# EAGLE design working (EAGLE 5.11)
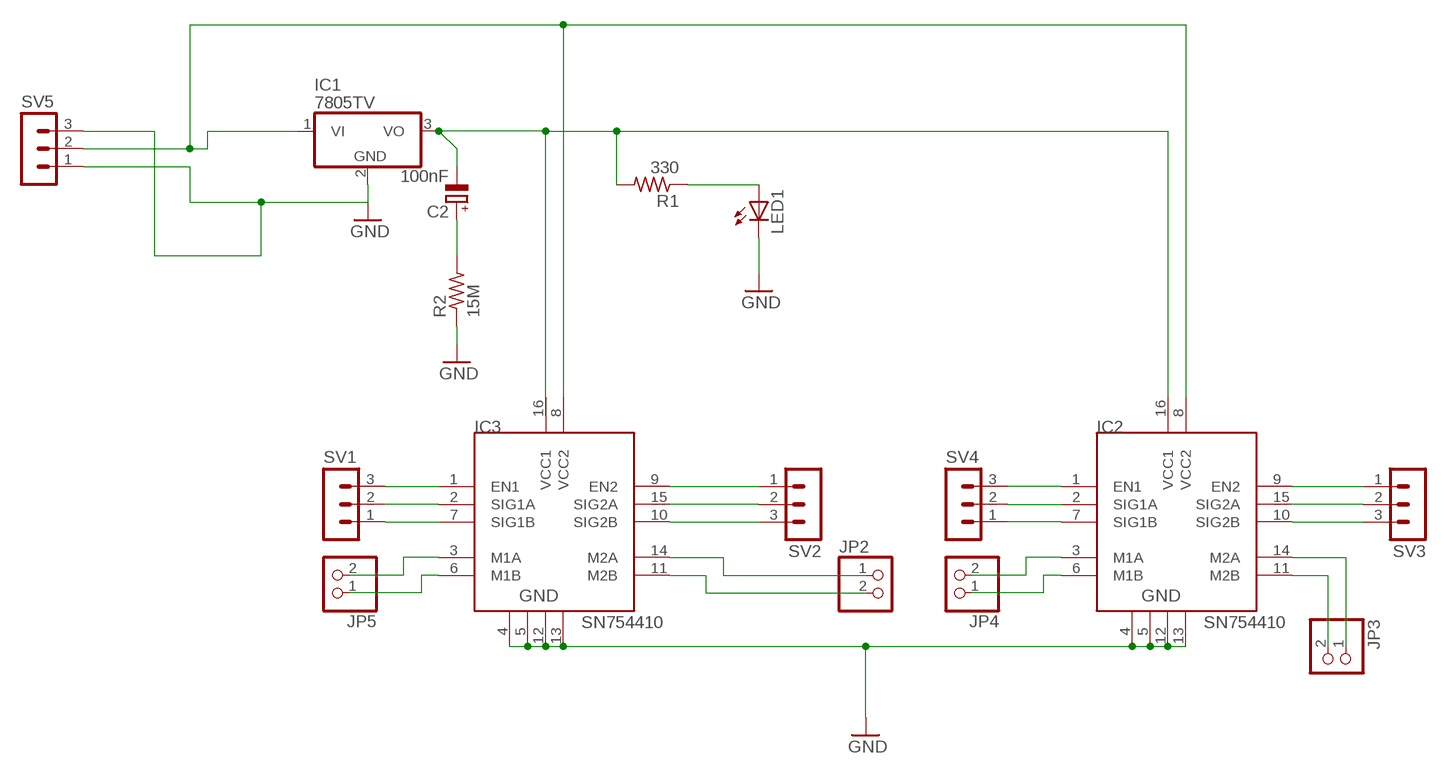
[diagram p0: schematic, sheet 1]

## Parts
C2  100nF  CPOL-EUE1.8-4  [E1,8-4]
IC1  7805TV  [TO220V]
IC2  SN754410  [DIP16]
IC3  SN754410  [DIP16]
JP2  PINHD-1X2  [1X02]
JP3  PINHD-1X2  [1X02]
JP4  PINHD-1X2  [1X02]
JP5  PINHD-1X2  [1X02]
LED1  LED5MM  [LED5MM]
R1  330  R-US_0204/5  [0204/5]
R2  15M  R-US_0204/5  [0204/5]
SV1  MA03-1  [MA03-1]
SV2  MA03-1  [MA03-1]
SV3  MA03-1  [MA03-1]
SV4  MA03-1  [MA03-1]
SV5  MA03-1  [MA03-1]

## Nets
GND: IC1.2(GND) IC2.4 IC2.5 IC2.12 IC2.13 IC3.4 IC3.5 IC3.12 IC3.13 LED1.K(C) R2.1 SV5.1 SV5.3
N$1: C2.- IC1.3(VO) IC2.16(VCC1) IC3.16(VCC1) R1.2
N$2: IC1.1(VI) IC2.8(VCC2) IC3.8(VCC2) SV5.2
N$3: IC3.1(EN1) SV1.3
N$4: IC3.2(SIG1A) SV1.2
N$5: IC3.7(SIG1B) SV1.1
N$6: IC3.3(M1A) JP5.2
N$7: IC3.6(M1B) JP5.1
N$8: IC3.11(M2B) JP2.2
N$9: IC3.14(M2A) JP2.1
N$10: IC3.9(EN2) SV2.1
N$11: IC3.15(SIG2A) SV2.2
N$12: IC3.10(SIG2B) SV2.3
N$13: IC2.1(EN1) SV4.3
N$14: IC2.2(SIG1A) SV4.2
N$15: IC2.7(SIG1B) SV4.1
N$16: IC2.3(M1A) JP4.2
N$17: IC2.6(M1B) JP4.1
N$18: IC2.11(M2B) JP3.2
N$19: IC2.14(M2A) JP3.1
N$20: IC2.9(EN2) SV3.1
N$21: IC2.15(SIG2A) SV3.2
N$22: IC2.10(SIG2B) SV3.3
N$23: C2.+ R2.2
N$25: LED1.A R1.1

## Library data of the parts
C2 = rcl:CPOL-EU: POLARIZED CAPACITOR, European symbol
IC1 = linear:78*: Positive VOLTAGE REGULATOR Source: http://cache.national.com/ds/LM/LM78L05.pdf http://www.fairchildsemi.com/ds/LM/LM7805.pdf
IC2 IC3 = HBridge:SN754410: Quadruple half-H driver
JP2-JP5 = pinhead:PINHD-1X2: PIN HEADER
LED1 = led:LED: LED OSRAM: - CHIPLED LG R971, LG N971, LY N971, LG Q971, LY Q971, LO R971, LY R971 LH N974, LH R974 LS Q976, LO Q976, LY Q976 LO Q996 - Hyper CHIPLED LW Q18S LB Q993, LB Q99A, LB R99A - SideLED LS A670, LO A670, LY A670, LG A670, LP A670 LB A673, LV A673, LT A673, LW A673 LH A674 LY A675 LS A676, LA A676, LO A676, LY A676, LW A676 LS A679, LY A679, LG A679 - Hyper Micro SIDELED® LS Y876, LA Y876, LO Y876, LY Y876 LT Y87S - SmartLED LW L88C, LW L88S LB L89C, LB L89S, LG L890 LS L89K, LO L89K, LY L89K LS L896, LA L896, LO L896, LY L896 - TOPLED LS T670, LO T670, LY T670, LG T670, LP T670 LSG T670, LSP T670, LSY T670, LOP T670, LYG T670 LG T671, LOG T671, LSG T671 LB T673, LV T673, LT T673, LW T673 LH T674 LS T676, LA T676, LO T676, LY T676, LB T676, LH T676, LSB T676, LW T676 LB T67C, LV T67C, LT T67C, LS T67K, LO T67K, LY T67K, LW E67C LS E67B, LA E67B, LO E67B, LY E67B, LB E67C, LV E67C, LT E67C LW T67C LS T679, LY T679, LG T679 LS T770, LO T770, LY T770, LG T770, LP T770 LB T773, LV T773, LT T773, LW T773 LH T774 LS E675, LA E675, LY E675, LS T675 LS T776, LA T776, LO T776, LY T776, LB T776 LHGB T686 LT T68C, LB T68C - Hyper Mini TOPLED® LB M676 - Mini TOPLED Santana® LG M470 LS M47K, LO M47K, LY M47K Source: http://www.osram.convergy.de LUXEON: - LUMILED® LXK2-PW12-R00, LXK2-PW12-S00, LXK2-PW14-U00, LXK2-PW14-V00 LXK2-PM12-R00, LXK2-PM12-S00, LXK2-PM14-U00 LXK2-PE12-Q00, LXK2-PE12-R00, LXK2-PE12-S00, LXK2-PE14-T00, LXK2-PE14-U00 LXK2-PB12-K00, LXK2-PB12-L00, LXK2-PB12-M00, LXK2-PB14-N00, LXK2-PB14-P00, LXK2-PB14-Q00 LXK2-PR12-L00, LXK2-PR12-M00, LXK2-PR14-Q00, LXK2-PR14-R00 LXK2-PD12-Q00, LXK2-PD12-R00, LXK2-PD12-S00 LXK2-PH12-R00, LXK2-PH12-S00 LXK2-PL12-P00, LXK2-PL12-Q00, LXK2-PL12-R00 Source: www.luxeon.com KINGBRIGHT: KA-3528ASYC Source: www.kingbright.com
R1 R2 = resistor:R-US_: RESISTOR, American symbol
SV1-SV5 = con-lstb:MA03-1: PIN HEADER; OC_FARNELL: unknown; OC_NEWARK: unknown

## Board
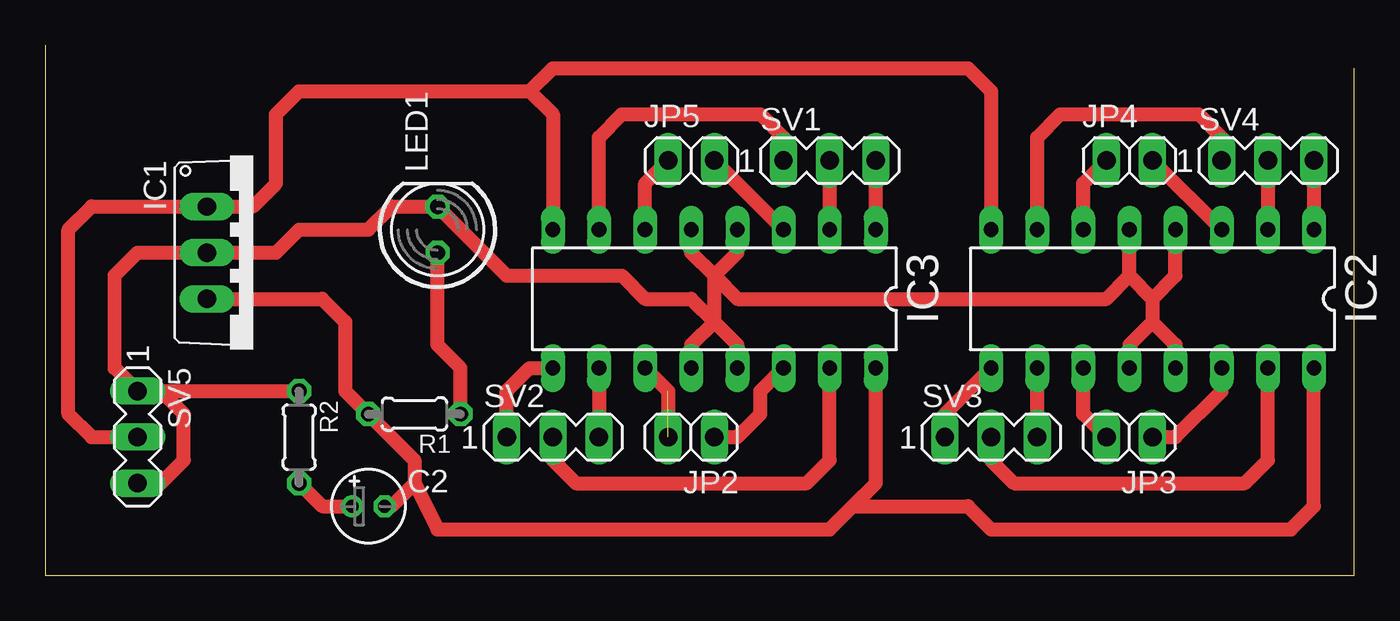
[diagram p1: board, top side]

Size 72.06 x 29.2 mm. Coordinates in mm from the lower left corner, seen from the top.
Outline: 72.06,27.93 72.06,0 0,0 0,29.2
Copper layers (1*16): Top 0.035mm / dielectric 1.5mm / Bottom 0.035mm
Design rules "default": minimum track width 10mil, minimum drill 24mil, track to track 8mil, track to pad 8mil, pad to pad 8mil, via to via 8mil, smd to smd 8mil, copper to edge 40mil, drill to drill 8mil, minimum pad ring 10mil, minimum via ring 8mil, stop-mask expansion 4mil, vias tented up to drill 0mil, thermal gap 10mil

### Footprints (pad centres in the part's own frame; a part is rotated, then mirrored left to right if it is on the bottom)
E1,8-4 = drill 0.711 pad 1.168 round: + -0.889,0 | drill 0.711 pad 1.168 octagon: - 0.889,0
TO220V = drill 1.016 long: 1 -2.54,-2.54; 2 0,-2.54; 3 2.54,-2.54
DIP16 = drill 0.813 long: 1 -10.16,-3.81; 2 -7.62,-3.81; 3 -5.08,-3.81; 4 -2.54,-3.81; 5 0,-3.81; 6 2.54,-3.81; 7 5.08,-3.81; 8 7.62,-3.81; 9 7.62,3.81; 10 5.08,3.81; 11 2.54,3.81; 12 0,3.81; 13 -2.54,3.81; 14 -5.08,3.81; 15 -7.62,3.81; 16 -10.16,3.81
1X02 = drill 1.016 long: 1 -1.27,0; 2 1.27,0
LED5MM = drill 0.813 octagon: A -1.27,0; K 1.27,0
0204/5 = drill 0.813 octagon: 1 -2.54,0; 2 2.54,0
MA03-1 = drill 1.016 long: 1 -2.54,0; 2 0,0; 3 2.54,0

### Placement (x,y rotation side)
C2  17.78,3.81 0 top
IC1  11.43,17.78 270 top
IC2  59.69,15.24 180 top
IC3  35.56,15.24 180 top
JP2  35.56,7.62 180 top
JP3  59.69,7.62 180 top
JP4  59.69,22.86 0 top
JP5  35.56,22.86 0 top
LED1  21.59,19.05 90 top
R1  20.32,8.89 180 top
R2  13.97,7.62 270 top
SV1  43.18,22.86 0 top
SV2  27.94,7.62 0 top
SV3  52.07,7.62 0 top
SV4  67.31,22.86 0 top
SV5  5.08,7.62 270 top

### Tracks (layer width: path | path; a pad name or v marks a point on that pad's centre or on a via)
GND
  Top 0.762: 6.35,10.16 SV5.1 3.81,11.43 3.81,16.51 5.08,17.78 IC1.2 12.7,17.78 13.97,19.05 17.78,19.05 19.05,20.32 LED1.K 25.4,16.51 31.75,16.51 33.02,15.24 35.56,15.24 36.83,13.97 | 6.35,10.16 R2.1 | SV5.3 6.35,5.08 7.62,6.35 7.62,8.89 6.35,10.16 | 60.96,13.97 62.23,12.7 IC2.13 | IC2.12 59.69,12.7 60.96,13.97 | 59.69,16.51 IC2.5 | 59.69,16.51 58.42,15.24 38.1,15.24 36.83,16.51 | 60.96,15.24 60.96,13.97 | 59.69,16.51 60.96,15.24 | IC2.4 62.23,16.51 60.96,15.24 | IC3.13 38.1,12.7 36.83,13.97 | 36.83,13.97 35.56,12.7 IC3.12 | IC3.5 35.56,17.78 36.83,16.51 | 36.83,16.51 38.1,17.78 IC3.4 | 36.83,13.97 36.83,16.51
N$1
  Top 0.762: IC1.3 15.24,15.24 16.51,13.97 16.51,10.16 R1.2 20.32,6.35 20.32,5.08 | C2.- 19.05,3.81 20.32,5.08 | 20.32,5.08 21.59,2.54 43.18,2.54 44.45,3.81 | 44.45,3.81 50.8,3.81 52.07,2.54 68.58,2.54 69.85,3.81 IC2.16 | IC3.16 45.72,5.08 44.45,3.81
N$2
  Top 0.762: SV5.2 2.54,7.62 1.27,8.89 1.27,19.05 2.54,20.32 IC1.1 11.43,20.32 12.7,21.59 12.7,25.4 13.97,26.67 26.67,26.67 | 26.67,26.67 27.94,25.4 IC3.8 | IC2.8 52.07,26.67 50.8,27.94 27.94,27.94 26.67,26.67
N$3
  Top 0.762: IC3.1 SV1.3
N$4
  Top 0.762: SV1.2 IC3.2
N$5
  Top 0.762: IC3.7 30.48,24.13 31.75,25.4 39.37,25.4 40.64,24.13 SV1.1
N$6
  Top 0.762: JP5.2 IC3.3
N$7
  Top 0.762: JP5.1 33.02,21.59 IC3.6
N$8  (1 unrouted)
  Top 0.762: IC3.11 34.29,10.16 JP2.2
N$9
  Top 0.762: JP2.1 38.1,7.62 39.37,8.89 39.37,10.16 IC3.14
N$10
  Top 0.762: IC3.9 26.67,11.43 25.4,10.16 SV2.1
N$11
  Top 0.762: SV2.2 27.94,6.35 29.21,5.08 41.91,5.08 43.18,6.35 IC3.15
N$12
  Top 0.762: IC3.10 SV2.3
N$13
  Top 0.762: SV4.3 IC2.1
N$14
  Top 0.762: SV4.2 IC2.2
N$15
  Top 0.762: IC2.7 54.61,24.13 55.88,25.4 63.5,25.4 64.77,24.13 SV4.1
N$16
  Top 0.762: JP4.2 IC2.3
N$17
  Top 0.762: IC2.6 57.15,21.59 JP4.1
N$18
  Top 0.762: IC2.11 57.15,8.89 JP3.2
N$19
  Top 0.762: IC2.14 64.77,10.16 62.23,7.62 JP3.1
N$20
  Top 0.762: IC2.9 49.53,8.89 SV3.1
N$21
  Top 0.762: SV3.2 52.07,6.35 53.34,5.08 66.04,5.08 67.31,6.35 IC2.15
N$22
  Top 0.762: SV3.3 IC2.10
N$23
  Top 0.762: R2.2 15.24,3.81 C2.+
N$25
  Top 0.762: LED1.A 21.59,12.7 22.86,11.43 R1.1